# EAGLE schematic Analog (EAGLE 6.1)
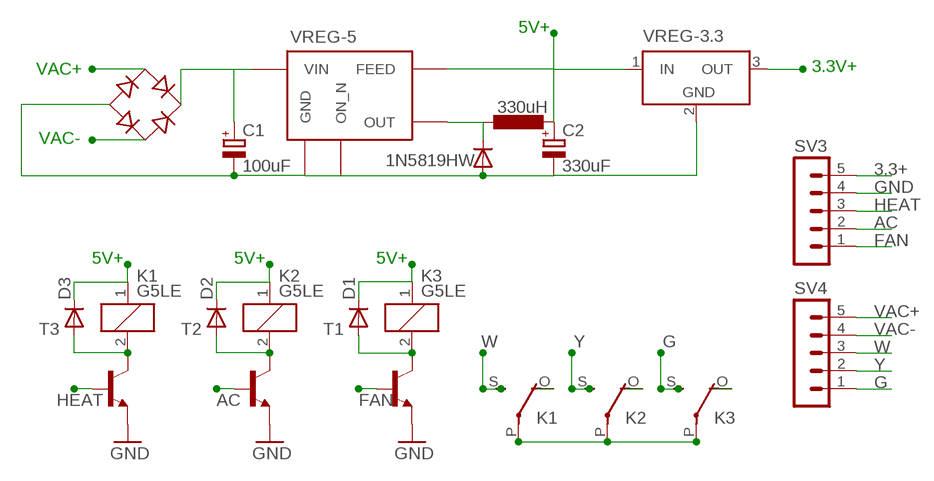
[diagram p0: schematic, sheet 1]

## Parts
B1  RECTIFIER-S80  [TO-269AA]
C1  100uF  CPOL-EU153CLV-0405  [153CLV-0405]
C2  330uF  CPOL-EU153CLV-0405  [153CLV-0405]
D1  1N4148DO35-7  [DO35-7]
D2  1N4148DO35-7  [DO35-7]
D3  1N4148DO35-7  [DO35-7]
D8  CGRM4001-G  [SOD-123_MINI-SMA]
K1  G5LE  [G5LE]
K2  G5LE  [G5LE]
K3  G5LE  [G5LE]
SV3  MA05-1  [MA05-1]
SV4  MA05-1  [MA05-1]
T1  2N4401-NPN-TO92-EBC  [TO92-EBC]
T2  2N4401-NPN-TO92-EBC  [TO92-EBC]
T3  2N4401-NPN-TO92-EBC  [TO92-EBC]
VREG-3.3  LT1129CST5  [SOT223]
VREG-5  TL2575-05  [TO-263-5]

## Nets
3.3+: SV3.5 VREG-3.3.3(OUT)
5V+: C2.+ D1.C D2.C D3.C K1.1 K2.1 K3.1 VREG-3.3.1(IN) VREG-5.4(FEED)
AC: SV3.2 T2.B
FAN: SV3.1 T1.B
G: K3.S(2:S) SV4.1
GND: B1.- C1.- C2.- D8.A SV3.4 T1.E T2.E T3.E VREG-3.3.2(GND) VREG-5.3(GND) VREG-5.5(ON_N) VREG-5.TAB(GND)
HEAT: SV3.3 T3.B
N$1: B1.+ C1.+ VREG-5.1(VIN)
N$2: D1.A K3.2 T1.C
N$3: D2.A K2.2 T2.C
N$4: D8.C VREG-5.2(OUT)
N$5: D3.A K1.2 T3.C
N$6: K1.O(2:O)
N$7: K2.O(2:O)
N$8: K3.O(2:O)
VAC+: B1.AC1 K1.P(2:P) K2.P(2:P) K3.P(2:P) SV4.5
VAC-: SV4.4
W: K1.S(2:S) SV4.3
Y: K2.S(2:S) SV4.2
Unconnected: B1.AC2

## Notes on the sheet
- 5V+
- VREG-5
- VAC+ | 3.3V+
- 330uH
- VAC-
- 1N5819HW
- 5V+ | 5V+ | 5V+
- W | Y | G

## Power pins joined to a net without a drawn wire
GND: VREG-3.3.4(GND)

## Library data of the parts
B1 = rectifier:RECTIFIER-: Rectifier
C1 C2 = rcl:CPOL-EU: POLARIZED CAPACITOR, European symbol
D1-D3 = diode:1N4148: DIODE high speed (Philips)
D8 = diode:CGRM400*-G: Molded plasitc,JEDEC SOD-123/Mini SMA Source: Comchip CGRM4001-G.pdf
K1-K3 = relay:G5LE: RELAY 1 x switch, 10 A/120 V AC, 8 A/30 V DC, Omron; OC_FARNELL: unknown; OC_NEWARK: unknown
SV3 SV4 = con-lstb:MA05-1: PIN HEADER; OC_FARNELL: unknown; OC_NEWARK: unknown
T1-T3 = transistor-neu-to92:*-NPN-: NPN Transistror
VREG-3.3 = linear-technology:LT1129CST5: VOLTAGE REGULATOR with shutdown; MPN: LT1129CST-5#PBF; OC_FARNELL: 1663375; OC_NEWARK: 57M2069
VREG-5 = texas:TL2575-05